# EAGLE design SNES_RGBAmp (EAGLE 6.4)
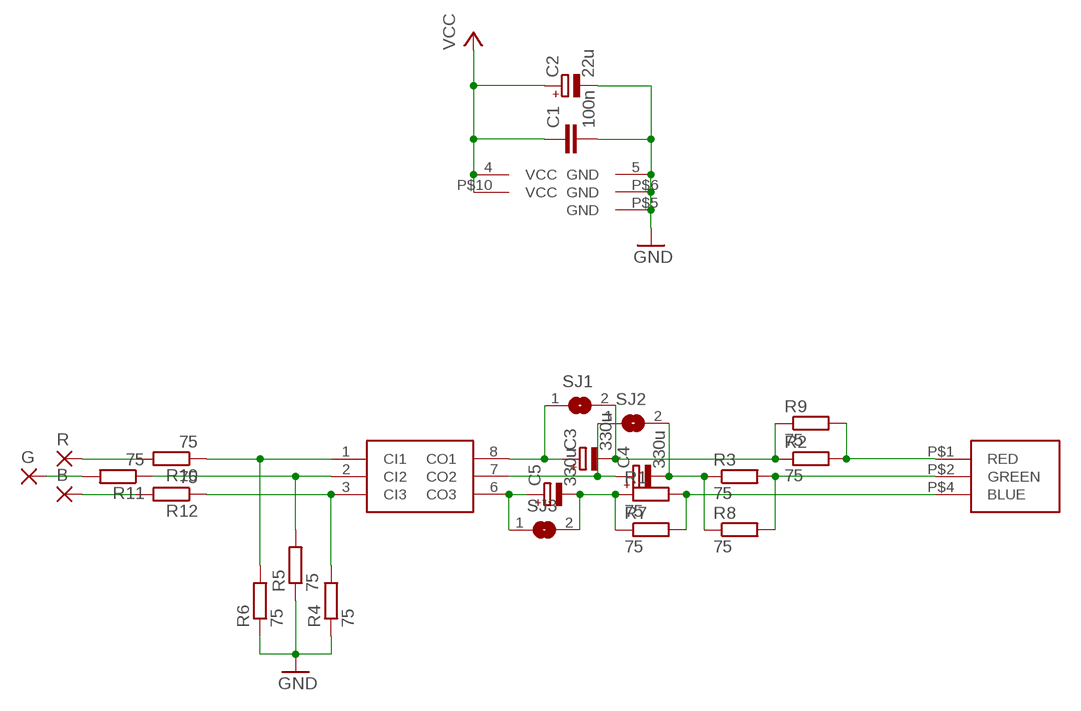
[diagram p0: schematic, sheet 1]

## Parts
B  SMD2  [SMD1,27-2,54]
C1  100n  C0805  [Z0805]
C2  22u  CPOL-EUSMCC  [SMC_C]
C3  330u  CPOL-EUSMCD  [SMC_D]
C4  330u  CPOL-EUSMCD  [SMC_D]
C5  330u  CPOL-EUSMCD  [SMC_D]
G  SMD2  [SMD1,27-2,54]
R  SMD2  [SMD1,27-2,54]
R1  75  R0805  [Z0805]
R2  75  R0805  [Z0805]
R3  75  R0805  [Z0805]
R4  75  R0805  [Z0805]
R5  75  R0805  [Z0805]
R6  75  R0805  [Z0805]
R7  75  R0805  [Z0805]
R8  75  R0805  [Z0805]
R9  75  R0805  [Z0805]
R10  75  R0805  [Z0805]
R11  75  R0805  [Z0805]
R12  75  R0805  [Z0805]
SJ1  SJ  [SJ]
SJ2  SJ  [SJ]
SJ3  SJ  [SJ]
U$1  THS7314  [THS7314]
U$2  SNES_MULTIAV_RGB_ONLY  [SNES_MULTIAV_RGB_ONLY]

## Nets
GND: C1.2 C2.- R4.1 R5.1 R6.1 U$1.5(GND) U$2.P$5(GND) U$2.P$6(GND)
N$1: R6.2 R10.1 U$1.1(CI1)
N$2: R5.2 R11.1 U$1.2(CI2)
N$3: R4.2 R12.1 U$1.3(CI3)
N$4: C3.- R2.1 R9.1 SJ1.2
N$5: R2.2 R9.2 U$2.P$1(RED)
N$6: R3.2 R8.2 U$2.P$2(GREEN)
N$7: C4.+ SJ2.1 U$1.7(CO2)
N$8: C5.- R1.1 R7.1 SJ3.2
N$9: R1.2 R7.2 U$2.P$4(BLUE)
N$11: C5.+ SJ3.1 U$1.6(CO3)
N$12: C3.+ SJ1.1 U$1.8(CO1)
N$13: C4.- R3.1 R8.1 SJ2.2
N$14: R10.2 R.1(P)
N$15: G.1(P) R11.2
N$16: B.1(P) R12.2
VCC: C1.1 C2.+ U$1.4(VCC) U$2.P$10(VCC)

## Library data of the parts
B G R = wirepad:SMD2: SMD PAD
C1 = snescart:C0805
C2-C5 = rcl:CPOL-EU: POLARIZED CAPACITOR, European symbol
R1-R12 = snescart:R0805
SJ1-SJ3 = jumper:SJ: SMD solder JUMPER
U$1 = snescart:THS7314
U$2 = snes_div:SNES_MULTIAV_RGB_ONLY

## Board
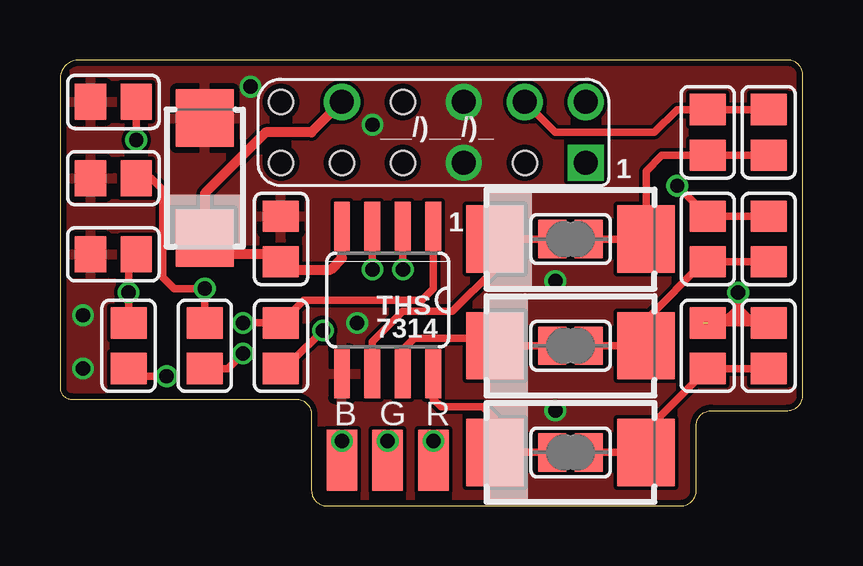
[diagram p1: board, top side]
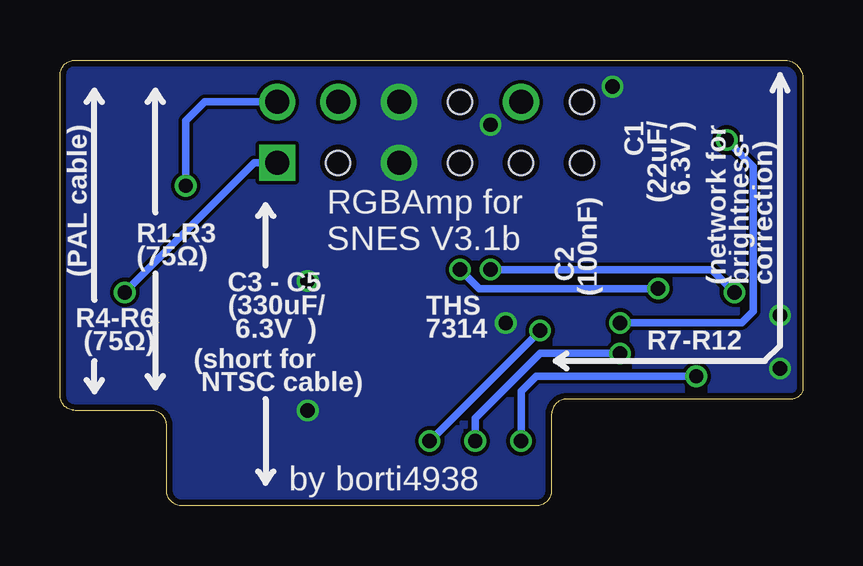
[diagram p2: board, bottom side, seen from below]

Size 30.96 x 18.57 mm. Coordinates in mm from the lower left corner, seen from the top.
Outline: 30.32,18.57 0.79,18.57 arc90 0,17.78 0,4.92 arc90 0.48,4.44 9.84,4.44 arc-90 10.48,3.81 10.48,0.63 arc90 11.11,0 25.88,0 arc90 26.51,0.63 26.51,3.33 arc-90 27.15,3.97 30.32,3.97 arc90 30.96,4.6 30.96,17.94 arc90 30.32,18.57
Copper layers (1*16): Top 0.035mm / dielectric 1.5mm / Bottom 0.035mm
Design rules "Elecrow_2-layer_eagle_rule": minimum track width 6mil, minimum drill 12mil, track to track 6mil, track to pad 6mil, pad to pad 6mil, via to via 6mil, smd to smd 0mil, copper to edge 10mil, drill to drill 10mil, minimum pad ring 10mil, minimum via ring 6mil, stop-mask expansion 2mil, vias tented up to drill 100mil, thermal gap 10mil

### Footprints (pad centres in the part's own frame; a part is rotated, then mirrored left to right if it is on the bottom)
SMD1,27-2,54 = smd 1.27 x 2.54: 1 0,0
Z0805 = smd 1.3 x 1.5: 1 -0.95,0; 2 0.95,0
SMC_C = smd 2.4 x 2.4: + -2.5,0; - 2.5,0
SMC_D = smd 2.4 x 2.8: + -3.15,0; - 3.15,0
SJ = smd 1.168 x 1.6: 1 -0.762,0; 2 0.762,0
THS7314 = smd 0.66 x 2.032: 1 -1.905,-3.073; 2 -0.635,-3.073; 3 0.635,-3.073; 4 1.905,-3.073; 5 1.905,3.073; 6 0.635,3.073; 7 -0.635,3.073; 8 -1.905,3.073
SNES_MULTIAV_RGB_ONLY = drill 1 square: P$1 6.35,-1.27 | drill 1: P$2 6.35,1.27; P$4 3.81,1.27; P$5 1.27,-1.27; P$6 1.27,1.27; P$10 -3.81,1.27 | hole 1: 3.81,-1.27; -1.27,1.27; -1.27,-1.27; -3.81,-1.27; -6.35,-1.27; -6.35,1.27

### Placement (x,y rotation side)
B  11.75,1.91 0 top
C1  9.21,11.11 90 top
C2  6.03,13.65 90 top
C3  21.27,2.22 0 top
C4  21.27,6.67 0 top
C5  21.27,11.11 0 top
G  13.65,1.91 0 top
R  15.56,1.91 0 top
R1  26.99,15.56 90 top
R2  26.99,6.67 90 top
R3  26.99,11.11 90 top
R4  2.22,10.48 0 top
R5  2.22,13.65 0 top
R6  2.22,16.83 0 top
R7  29.53,15.56 90 top
R8  29.53,11.11 90 top
R9  29.53,6.67 90 top
R10  9.21,6.67 270 top
R11  6.03,6.67 270 top
R12  2.86,6.67 270 top
SJ1  21.27,2.22 0 top
SJ2  21.27,6.67 0 top
SJ3  21.27,11.11 0 top
U$1  13.65,8.57 180 top
U$2  15.56,15.56 0 top

### Tracks (layer width: path | path; a pad name or v marks a point on that pad's centre or on a via)
GND  (via drill 0.6)
  other vias: 7.94,17.46 20.64,3.97 13.02,15.88 20.64,9.37 12.38,7.62 0.95,7.94 0.95,5.71
  pour Bottom: -0.95,20 34.61,20 34.61,-1.59 -0.95,-1.59
  pour Top (rank 2): -0.95,20 -0.95,-1.59 34.61,-1.59 34.61,20
  pour Bottom (no thermals): 15.56,18.73 18.1,18.73 18.1,13.02 15.56,13.02
  pour Top (no thermals): 15.56,18.73 18.1,18.73 18.1,13.02 15.56,13.02
N$1  (via drill 0.6)
  Top 0.305: v7.62,7.62 R10.1 10.16,8.57 15.08,8.57 15.56,9.05 U$1.1 | v3.17,15.24 R6.2
  Bottom 0.305: v7.62,7.62 2.54,7.62 2.06,8.1 2.06,14.13 v3.17,15.24
N$2  (via drill 0.6)
  Top 0.305: R11.1 v6.03,9.05 4.76,9.05 4.29,9.53 4.29,13.18 3.81,13.65 R5.2 | v14.29,9.84 U$1.2
  Bottom 0.305: v6.03,9.05 13.49,9.05 v14.29,9.84
N$3  (via drill 0.6)
  Top 0.305: 2.86,10.16 R4.2 2.86,10.48 v2.86,8.89 R12.1 | v13.02,9.84 U$1.3
  Bottom 0.305: v2.86,8.89 3.81,9.84 v13.02,9.84
N$4
  Top 0.305: R9.1 R2.1 24.42,3.15 C3.- SJ1.2
N$5  (via drill 0.6)  (1 unrouted)
  Top 0.305: 26.83,7.62 27.62,7.62 | 27.62,7.62 28.26,8.26 | 28.26,8.26 28.89,7.62 27.94,7.62 | 27.62,7.62 27.94,7.62 | 27.94,7.62 28.26,7.94 28.42,7.78 29.37,7.78 R9.2 | 28.26,8.26 v28.26,8.89
  Bottom 0.305: v28.26,8.89 22.86,14.29 U$2.P$1
N$6  (via drill 0.6)
  Top 0.305: R8.2 R3.2 v25.72,13.34
  Bottom 0.305: v25.72,13.34 25.72,16.03 24.92,16.83 U$2.P$2
N$7
  Top 0.305: U$1.7 14.29,6.51 14.76,6.99 17.81,6.99 C4.+ SJ2.1
N$8
  Top 0.305: R7.1 R1.1 25.08,14.6 24.42,13.95 C5.- SJ3.2
N$9
  Top 0.305: U$2.P$4 20.64,15.56 24.76,15.56 25.72,16.51 R1.2 R7.2
N$11
  Top 0.305: U$1.6 13.02,6.83 14.29,8.1 16.35,8.1 18.1,9.84 18.1,11.09 C5.+ SJ3.1
N$12
  Top 0.305: U$1.8 15.56,4.44 15.88,4.13 17.62,4.13 18.12,3.63 C3.+ SJ1.1
N$13
  Top 0.305: R8.1 R3.1 26.83,10.16 24.45,7.78 24.45,6.69 C4.- SJ2.2
N$14  (via drill 0.6)
  Top 0.305: R.1 v15.56,2.7 | v10.95,7.3 9.68,6.03 9.52,6.03 R10.2
  Bottom 0.305: v15.56,2.7 v10.95,7.3
N$15  (via drill 0.6)
  Top 0.305: G.1 v13.65,2.7 | v7.62,6.35 6.98,5.71 R11.2
  Bottom 0.305: v13.65,2.7 13.65,3.65 10.95,6.35 v7.62,6.35
N$16  (via drill 0.6)
  Top 0.305: B.1 v11.75,2.7 | v4.44,5.4 2.54,5.4 R12.2
  Bottom 0.305: v11.75,2.7 11.75,4.76 11.11,5.4 v4.44,5.4
VCC
  Top 0.406: U$1.4 11.75,10.32 11.27,9.84 9.21,9.84 C1.1 9.21,10.48 6.03,10.48 C2.+ 6.03,13.02 8.57,15.56 10.48,15.56 U$2.P$10

### Text on the board
tPlace: __/)__/)_ | 1 | 1 | THS / 7314
bPlace: RGBAmp for / SNES V3.1b | THS / 7314 | by borti4938
bNames: C1 / (22uF/ / 6.3V ) | R1-R3 / (75Ω) | (PAL cable) | (network for / brightness- / correction) | C2 / (100nF) | R4-R6 / (75Ω) | R7-R12 | C3 - C5 / (330uF/ / 6.3V ) | (short for / NTSC cable)